# EAGLE design tooth (EAGLE 6.1)
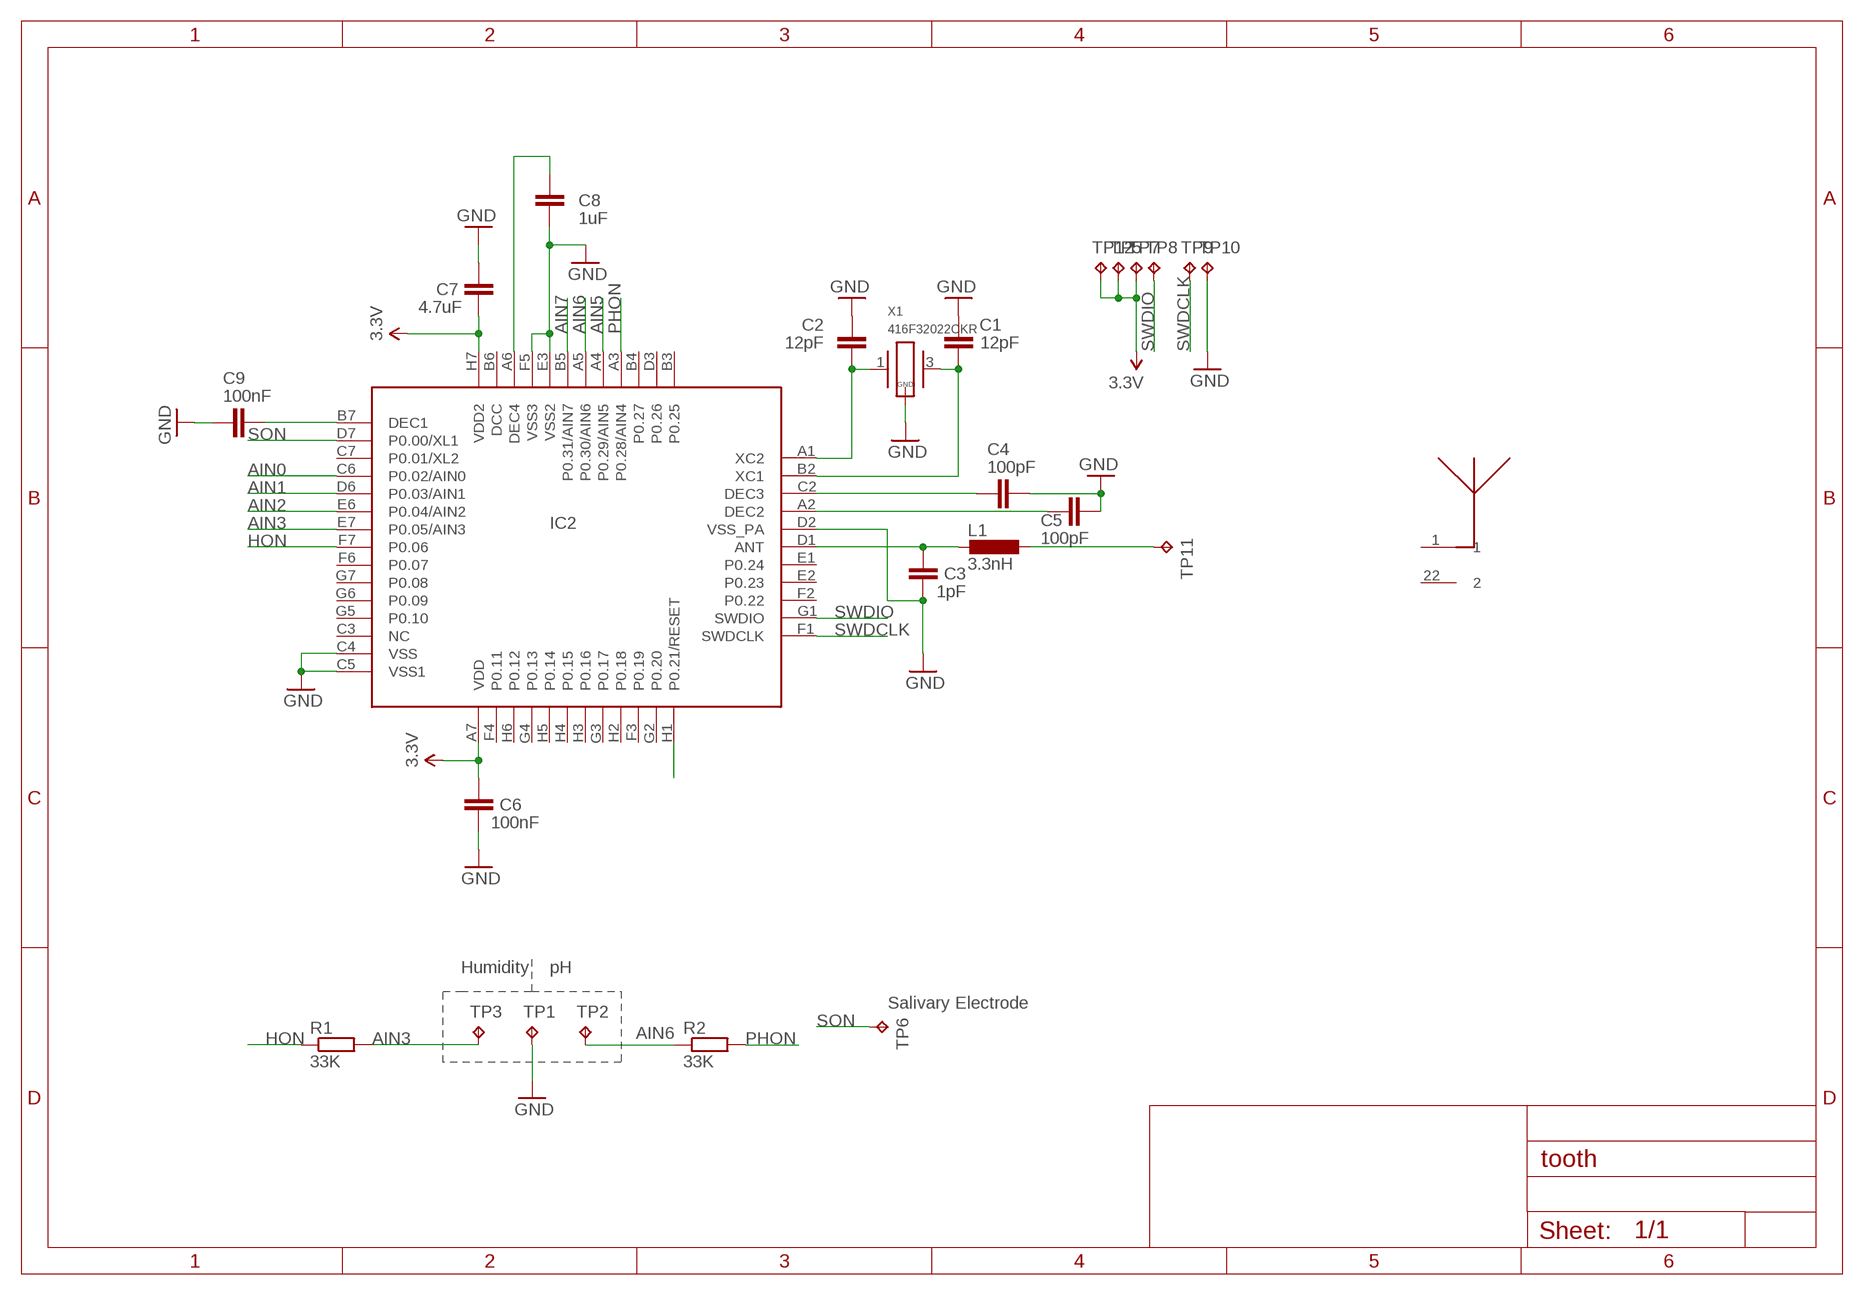
[diagram p0: schematic, sheet 1]

## Parts
C1  12pF  C-EUC0201  [C0201]
C2  12pF  C-EUC0201  [C0201]
C3  1pF  C-EUC0201  [C0201]
C4  100pF  C-EUC0201  [C0201]
C5  100pF  C-EUC0201  [C0201]
C6  100nF  C-EUC0201  [C0201]
C7  4.7uF  C-EUC0402  [C0402]
C8  1uF  C-EUC0402  [C0402]
C9  100nF  C-EUC0201  [C0201]
IC2  NRF52832  [NRF52832_WLCSP]
L1  3.3nH  L-EUL0201  [L0201]
R1  33K  R-EU_R0201  [R0201]
R2  33K  R-EU_R0201  [R0201]
TP1  TPTP10R  [TP10R]
TP2  TPTP10R  [TP10R]
TP3  TPTP10R  [TP10R]
TP5  TPTP15R  [TP15R]
TP6  TPTP15R  [TP15R]
TP7  TPTP15R  [TP15R]
TP8  TPTP15R  [TP15R]
TP9  TPTP15R  [TP15R]
TP10  TPTP15R  [TP15R]
TP11  TPTP10R  [TP10R]
TP12  TPTP15R  [TP15R]
U$1  ACA-102-T  [ACA-102-T]
X1  416F32022CKR  M416F26022CKR  [M416]

## Nets
3.3V: C6.2 C7.2 IC2.A7(VDD) IC2.H7(VDD2) TP5.TP TP7.TP TP12.TP
AIN0: IC2.C6(P0.02/AIN0)
AIN1: IC2.D6(P0.03/AIN1)
AIN2: IC2.E6(P0.04/AIN2)
AIN3: IC2.E7(P0.05/AIN3) R1.2 TP3.TP
AIN5: IC2.A4(P0.29/AIN5)
AIN6: IC2.A5(P0.30/AIN6) R2.1 TP2.TP
AIN7: IC2.B5(P0.31/AIN7)
GND: C1.1 C2.1 C3.2 C4.2 C5.2 C6.1 C7.1 C8.2 C9.2 IC2.C4(VSS) IC2.C5(VSS1) IC2.D2(VSS_PA) IC2.E3(VSS2) IC2.F5(VSS3) TP1.TP TP10.TP X1.2(GND) X1.4(GND)
HON: IC2.F7(P0.06) R1.1
N$1: IC2.H1(P0.21/RESET)
N$2: C2.2 IC2.A1(XC2) X1.1
N$3: L1.1 TP11.TP
N$6: C1.2 IC2.B2(XC1) X1.3
N$9: C4.1 IC2.C2(DEC3)
N$10: C5.1 IC2.A2(DEC2)
N$12: C3.1 IC2.D1(ANT) L1.2
N$19: C9.1 IC2.B7(DEC1)
N$20: C8.1 IC2.A6(DEC4)
PHON: IC2.A3(P0.28/AIN4) R2.2
SON: IC2.D7(P0.00/XL1) TP6.TP
SWDCLK: IC2.F1(SWDCLK) TP9.TP
SWDIO: IC2.G1(SWDIO) TP8.TP
Unconnected: IC2.B3(P0.25) IC2.B4(P0.27) IC2.B6(DCC) IC2.C3(NC) IC2.C7(P0.01/XL2) IC2.D3(P0.26) IC2.E1(P0.24) IC2.E2(P0.23) IC2.F2(P0.22) IC2.F3(P0.19) IC2.F4(P0.11) IC2.F6(P0.07) IC2.G2(P0.20) IC2.G3(P0.17) IC2.G4(P0.13) IC2.G5(P0.10) IC2.G6(P0.09) IC2.G7(P0.08) IC2.H2(P0.18) IC2.H3(P0.16) IC2.H4(P0.15) IC2.H5(P0.14) IC2.H6(P0.12) U$1.1 U$1.22

## Notes on the sheet
- Humidity | pH
- Salivary Electrode

## Library data of the parts
C1-C9 = rcl:C-EU: CAPACITOR, European symbol
IC2 = dan:NRF52832
L1 = rcl:L-EU: INDUCTOR, European symbol
R1 R2 = rcl:R-EU_: RESISTOR, European symbol
TP1-TP3 TP5-TP12 = testpad:TP: Test pad
U$1 = dan:ACA-102-T
X1 = crystals:M416; DIGIKEY: CTX1407CT-ND

## Net classes
1 power: width 0.61 mm

## Board
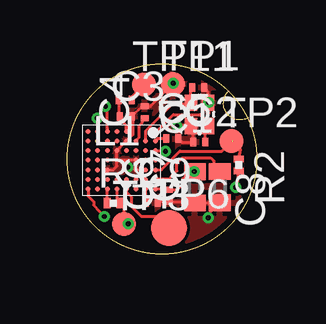
[diagram p1: board, top side]
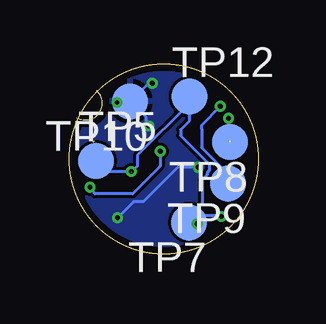
[diagram p2: board, bottom side, seen from below]

Size 7.9 x 7.9 mm. Coordinates in mm from the lower left corner, seen from the top.
Outline: 7.58,5.68 arc-170 6.75,6.8
Outline: circle at 3.95,3.95 radius 3.95
Copper layers (1*16): Top 0.035mm / dielectric 1.5mm / Bottom 0.035mm
Design rules: minimum track width 0.125mm, minimum drill 0.2mm, track to track 0.125mm, track to pad 0.125mm, pad to pad 0.125mm, via to via 0.125mm, smd to smd 0.125mm, copper to edge 0.3mm, drill to drill 0.2mm, minimum pad ring 0.2mm, minimum via ring 0.125mm, stop-mask expansion 0.075mm, vias tented up to drill 0mil, thermal gap 0.2mm

### Footprints (pad centres in the part's own frame; a part is rotated, then mirrored left to right if it is on the bottom)
C0201 = smd 0.25 x 0.35: 1 -0.25,0; 2 0.25,0
C0402 = smd 0.7 x 0.9: 1 -0.65,0; 2 0.65,0
NRF52832_WLCSP = smd 0.2 x 0.2: A1 -1.2,1.4; A2 -0.8,1.4; A3 -0.4,1.4; A4 0,1.4; A5 0.4,1.4; A6 0.8,1.4; A7 1.2,1.4; B2 -0.8,1; B3 -0.4,1; B4 0,1; B5 0.4,1; B6 0.8,1; B7 1.2,1; C2 -0.8,0.6; C3 -0.4,0.6; C4 0,0.6; C5 0.4,0.6; C6 0.8,0.6; C7 1.2,0.6; D1 -1.2,0.2; D2 -0.8,0.2; D3 -0.4,0.2; D6 0.8,0.2; D7 1.2,0.2; E1 -1.2,-0.2; E2 -0.8,-0.2; E3 -0.4,-0.2; E6 0.8,-0.2; E7 1.2,-0.2; F1 -1.2,-0.6; F2 -0.8,-0.6; F3 -0.4,-0.6; F4 0,-0.6; F5 0.4,-0.6; F6 0.8,-0.6; F7 1.2,-0.6; G1 -1.2,-1; G2 -0.8,-1; G3 -0.4,-1; G4 0,-1; G5 0.4,-1; G6 0.8,-1; G7 1.2,-1; H1 -1.2,-1.4; H2 -0.8,-1.4; H3 -0.4,-1.4; H4 0,-1.4; H5 0.4,-1.4; H6 0.8,-1.4; H7 1.2,-1.4
L0201 = smd 0.25 x 0.35: 1 -0.275,0; 2 0.275,0
R0201 = smd 0.28 x 0.43: 1 -0.255,0; 2 0.255,0
TP10R = smd 1 x 1: TP 0,0
TP15R = smd 1.5 x 1.5: TP 0,0
ACA-102-T = smd 2.1 x 0.5: 1 0,-0.5; 22 0,0.5
M416 = smd 0.67 x 0.52: 1 -0.485,-0.36; 2 0.485,-0.36; 3 0.485,0.36; 4 -0.485,0.36

### Placement (x,y rotation side)
C1  5.46,6.93 180 top
C2  5.5,4.66 0 top
C3  2.45,5.73 0 top
C4  3.23,5.89 90 top
C5  4.37,4.8 0 top
C6  4.23,2.42 90 top
C7  5.32,2.77 90 top
C8  6.36,2.78 270 top
C9  3.53,2.13 0 top
IC2  2.27,3.9 270 top
L1  2.42,6.4 180 top
R1  1.92,2.11 0 top
R2  7.15,3.7 270 top
TP1  4.4,7.07 0 top
TP2  6.86,4.71 0 top
TP3  2.37,1.25 0 top
TP5  6.78,3.88 0 bottom
TP6  4.25,1.07 0 top
TP7  2.9,1.3 180 bottom
TP8  1.2,4.65 180 bottom
TP9  1.28,2.93 180 bottom
TP10  5.35,6.35 180 bottom
TP11  3.2,7.05 0 top
TP12  2.88,6.55 0 bottom
U$1  3.15,12.05 0 top  (outside the outline)
X1  5.52,5.81 90 top

### Tracks (layer width: path | path; a pad name or v marks a point on that pad's centre or on a via)
3.3V  (via drill 0.2)  (1 unrouted)
  Top 0.125: IC2.H7 0.87,2.41 1.1,2.18 1.1,2.03 v1.55,1.55 | IC2.A7 4.2,2.7 C6.2 4.6,2.67 4.83,2.9 4.83,3.12 C7.2 5.12,3.36 v5.3,3.43 5.25,3.4 5.17,3.45 | v2.55,1.25 2.65,1.2 2.55,1.2 2.55,1.22
  Bottom 0.125: v1.55,1.55 1.6,1.6 2.6,1.6 TP7.TP 2.72,1 3.15,0.88 v2.55,1.25 2.88,1.57 2.35,2.1 2.35,3.07 2.2,3.23 arc-45 2.12,3.4 2.05,3.48 2.05,3.62 2.05,3.73 3.25,4.93 3.25,5.18 2.88,5.55 TP12.TP 2.88,6.28 5.05,4.1 5.05,3.65 5.28,3.43 | v1.55,1.55 1.53,1.53 v1.55,1.55 | v5.3,3.43 6.33,3.43 TP5.TP
AIN3
  Top 0.125: IC2.E7 2.07,2.21 R1.2 2.37,1.91 TP3.TP
AIN6  (2 unrouted)
  Top 0.125: IC2.A5 3.92,3.5 4.7,4.28 6.45,4.28 6.88,4.7 TP2.TP | 6.92,4.62 6.88,4.68 | R2.1 7.22,4.35 6.9,4.68
GND  (via drill 0.2)
  Top 0.125: IC2.F5 1.92,3.5 2.08,3.65 2.08,3.8 | 2.08,3.8 IC2.E3 IC2.D2 2.75,4.98 2.75,5.7 2.72,5.73 C3.2 3.12,6.14 C4.2 3.47,6.14 TP1.TP 4.53,7.2 v4.42,7.1 | 2.08,3.8 2.17,3.9 IC2.C4 IC2.C5 2.79,3.57 2.62,3.57 v2.53,3.6 | C6.1 3.82,2.17 C9.2 | C6.1 5.07,2.17 C7.1 6.17,2.12 C8.2 5.88,1.65 v5.88,1.5 | 4.28,2.12 C6.1 | C1.1 5.88,6.75 X1.2 v5.9,6.3 | C5.2 4.78,4.65 5.2,4.65 5.22,4.68 | C2.1 5.25,5.23 X1.4 v4.58,5.32
  Bottom 0.125: v5.9,6.3 5.7,6 TP10.TP | TP10.TP 4.7,5.7 4.7,5.45 v4.58,5.32 | TP10.TP 5.35,6.82 | v4.42,7.1 4.58,7.1 5.35,6.32 TP10.TP | v2.53,3.6 3.37,3.6 4.8,2.17 5.21,2.17 v5.88,1.5
  pour Top: 8.6,8.99 -1.23,8.84 -1.3,-3.41 11.64,-3.26 11.71,9
  pour Bottom: 12.07,9.56 11.98,-2.67 -0.59,-2.87 -0.31,9.41
HON
  Top 0.125: R1.1 IC2.F7
N$2
  Top 0.12: 4.78,5.8 5.53,5.8
  Top 0.125: C2.2 5.75,5.17 5.88,5.3 X1.1 5.88,5.45 5.53,5.8 | IC2.A1 3.72,5.1 4.42,5.8 4.78,5.8
N$3
  Top 0.125: TP11.TP 3.15,7.1 TP11.TP | L1.1 2.7,6.55 TP11.TP
N$6
  Top 0.125: C1.2 5.15,6.85 X1.3 5.11,6.25 4.4,6.25 3.27,5.12 IC2.B2
N$9
  Top 0.125: IC2.C2 2.87,4.72 2.92,4.78 3,4.85 3,5.32 3.12,5.45 3.12,5.53 3.2,5.6 C4.1
N$10
  Top 0.125: C5.1 3.77,4.8 IC2.A2
N$12
  Top 0.125: IC2.D1 2.47,5.36 2.28,5.55 2.28,5.7 | 2.28,5.7 2.28,5.73 C3.1 | C3.1 2.22,5.78 2.22,5.75 2.2,5.75 2.22,5.73 | C3.1 2.25,5.73 2.28,5.7 | 2.28,5.7 2.25,5.7 2.22,5.73 | 2.22,5.73 2.22,5.7 2.22,5.73 | L1.2 2.15,5.78 C3.1
N$19
  Top 0.125: C9.1 IC2.B7
N$20
  Top 0.125: 6.18,3.57 C8.1 6.21,3.43 6.2,3.43 6.1,3.53 6.1,3.88 5.97,4 4.8,4 4.58,3.78 4.58,3.45 4.45,3.32 4.22,3.1 IC2.A6
PHON  (via drill 0.2)
  Top 0.125: IC2.A3 4.08,4.3 v4.1,4.28 | v7.03,2.78 7.1,3.02 R2.2
  Bottom 0.125: v4.1,4.28 4.1,3.65 5.25,2.5 6.83,2.5 v7.03,2.78
SON
  Top 0.125: IC2.D7 2.47,2.58 2.67,2.38 2.67,1.98 2.88,1.78 3.08,1.57 3.78,1.57 4.35,1 4.35,1.03 TP6.TP
SWDCLK  (via drill 0.2)
  Top 0.125: IC2.F1 1.67,5.22 1.67,5.5 1.67,6.15 v1.6,6.15
  Bottom 0.125: TP9.TP 1.45,3.1 1.45,3.5 2.38,4.43 2.38,5.2 2.38,5.35 v1.6,6.15
SWDIO  (via drill 0.2)  (1 unrouted)
  Top 0.125: IC2.G1 1.27,5.72 v1.25,5.65
  Bottom 0.125: v1.25,5.65 1.28,4.8 1.2,4.73 1.1,4.73 1.05,4.68